# EAGLE schematic VentingSysPCB (EAGLE 9.6.1)
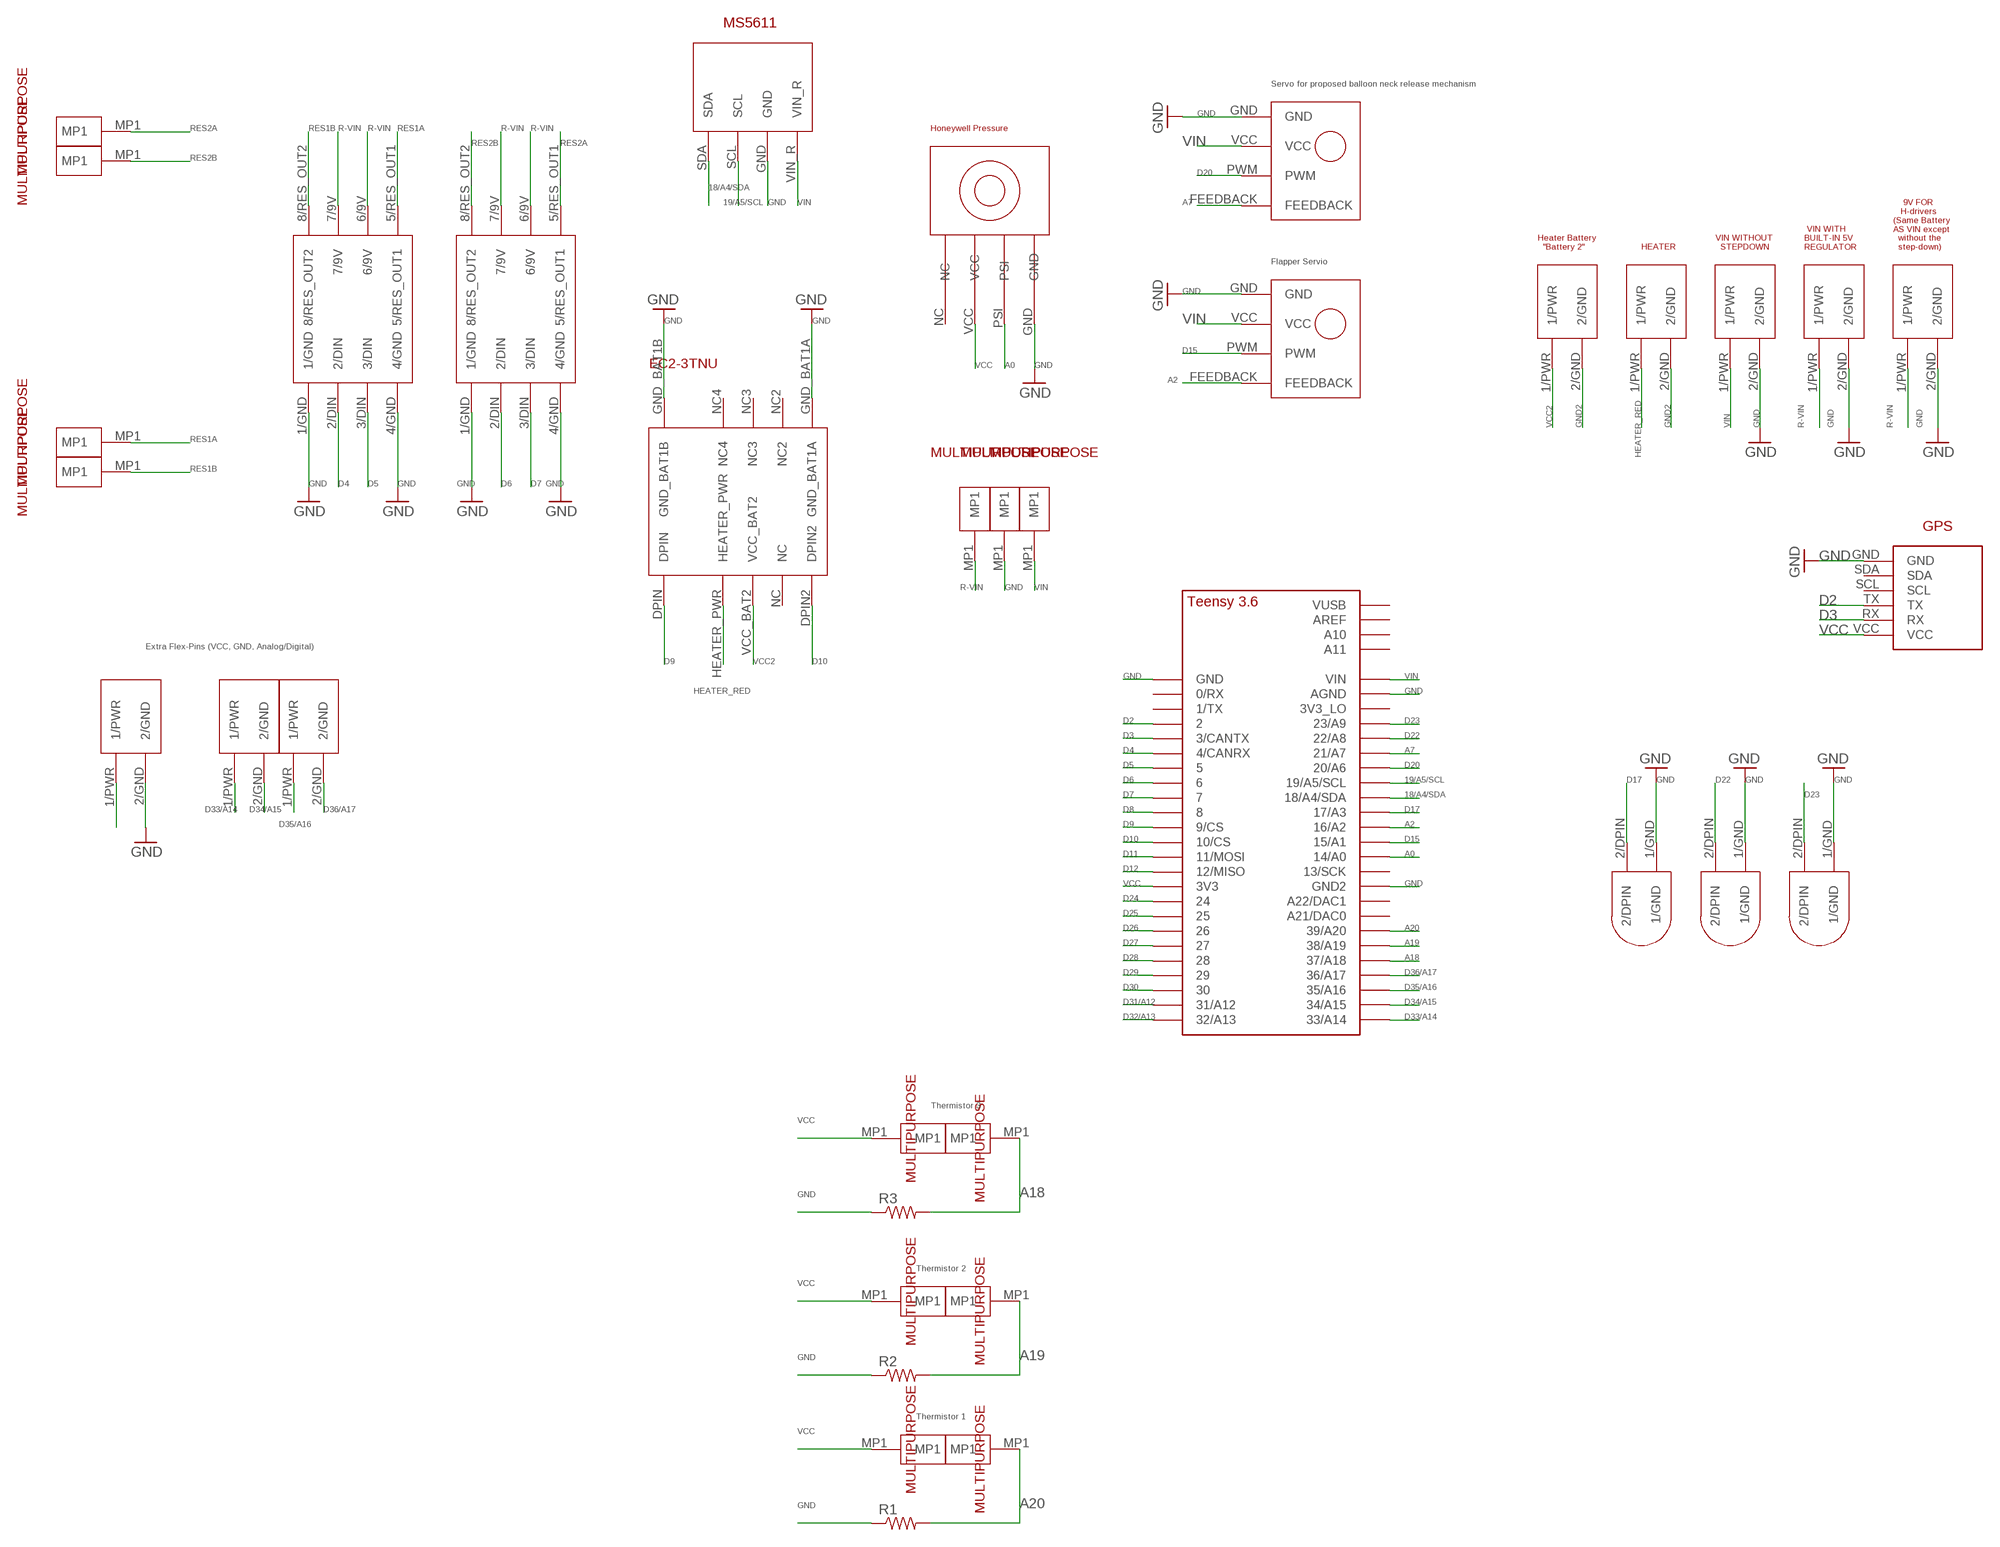
[diagram p0: schematic, sheet 1]

## Parts
R1  R-US_0204/7  [0204/7]
R2  R-US_0204/7  [0204/7]
R3  R-US_0204/7  [0204/7]
U$1  MULTIPURPOSE  [MULTIPURPOSE]
U$2  TEENSY_3.5/3.6_BASIC  [TEENSY_3.5/3.6_BASIC]
U$3  MULTIPURPOSE  [MULTIPURPOSE]
U$4  3V3_H-DRIVER  [3V3_H-DRIVER]
U$5  MULTIPURPOSE  [MULTIPURPOSE]
U$6  3V3_H-DRIVER  [3V3_H-DRIVER]
U$7  ADAFRUIT_LED  [ADAFRUIT_LED]
U$8  MULTIPURPOSE  [MULTIPURPOSE]
U$10  MULTIPURPOSE  [MULTIPURPOSE]
U$12  ADAFRUIT_LED  [ADAFRUIT_LED]
U$13  ADAFRUIT_LED  [ADAFRUIT_LED]
U$14  MULTIPURPOSE  [MULTIPURPOSE]
U$15  MULTIPURPOSE  [MULTIPURPOSE]
U$16  EC2-3TNU_LATCH_RELAY  [EC2-3TNU_LATCH_RELAY]
U$17  FEEDBACK_SERVO  [FEEDBACK_SERVO]
U$18  HONEYWELL_PRESSURE  [HONEYWELL_PRESSURE]
U$19  MS5611_PRESSURE  [MS5611_PRESSURE]
U$20  MULTIPURPOSE  [MULTIPURPOSE]
U$21  MULTIPURPOSE  [MULTIPURPOSE]
U$22  MULTIPURPOSE  [MULTIPURPOSE]
U$23  MULTIPURPOSE  [MULTIPURPOSE]
U$24  TERMINAL_BLOCK  [TERMINAL_BLOCK]
U$25  TERMINAL_BLOCK  [TERMINAL_BLOCK]
U$26  TERMINAL_BLOCK  [TERMINAL_BLOCK]
U$27  TERMINAL_BLOCK  [TERMINAL_BLOCK]
U$28  TERMINAL_BLOCK  [TERMINAL_BLOCK]
U$29  UBLOX-8-GPS  [UBLOX-8-NEO]
U$30  FEEDBACK_SERVO  [FEEDBACK_SERVO]
U$31  TERMINAL_BLOCK  [TERMINAL_BLOCK]
U$32  TERMINAL_BLOCK  [TERMINAL_BLOCK]
U$33  TERMINAL_BLOCK  [TERMINAL_BLOCK]
U$34  MULTIPURPOSE  [MULTIPURPOSE]
U$35  MULTIPURPOSE  [MULTIPURPOSE]

## Nets
18/A4/SDA: U$2.18/A4/SDA U$19.SDA
19/A5/SCL: U$2.19/A5/SCL U$19.SCL
A0: U$2.14/A0 U$18.PSI
A2: U$2.16/A2 U$17.FEEDBACK
A7: U$2.21/A7 U$30.FEEDBACK
A18: R3.2 U$2.37/A18 U$5.MP1
A19: R2.2 U$2.38/A19 U$14.MP1
A20: R1.2 U$2.39/A20 U$34.MP1
D2: U$2.2 U$29.TX
D3: U$2.3/CANTX U$29.RX
D4: U$2.4/CANRX U$6.2/DIN
D5: U$2.5 U$6.3/DIN
D6: U$2.6 U$4.2/DIN
D7: U$2.7 U$4.3/DIN
D8: U$2.8
D9: U$2.9/CS U$16.DPIN
D10: U$2.10/CS U$16.DPIN2
D11: U$2.11/MOSI
D12: U$2.12/MISO
D15: U$2.15/A1 U$17.PWM
D17: U$2.17/A3 U$7.2/DPIN
D20: U$2.20/A6 U$30.PWM
D22: U$2.22/A8 U$12.2/DPIN
D23: U$2.23/A9 U$13.2/DPIN
D24: U$2.24
D25: U$2.25
D26: U$2.26
D27: U$2.27
D28: U$2.28
D29: U$2.29
D30: U$2.30
D31/A12: U$2.31/A12
D32/A13: U$2.32/A13
D33/A14: U$2.33/A14 U$32.1/PWR
D34/A15: U$2.34/A15 U$32.2/GND
D35/A16: U$2.35/A16 U$33.1/PWR
D36/A17: U$2.36/A17 U$33.2/GND
GND: R1.1 R2.1 R3.1 U$2.AGND U$2.GND U$2.GND2 U$3.MP1 U$4.1/GND U$4.4/GND U$6.1/GND U$6.4/GND U$7.1/GND U$12.1/GND U$13.1/GND U$16.GND_BAT1A U$16.GND_BAT1B U$17.GND U$18.GND U$19.GND U$26.2/GND U$27.2/GND U$28.2/GND U$29.GND U$30.GND U$31.2/GND
GND2: U$24.2/GND U$25.2/GND
HEATER_RED: U$16.HEATER_PWR U$25.1/PWR
R-VIN: U$1.MP1 U$4.6/9V U$4.7/9V U$6.6/9V U$6.7/9V U$27.1/PWR U$28.1/PWR
RES1A: U$6.5/RES_OUT1 U$21.MP1
RES1B: U$6.8/RES_OUT2 U$20.MP1
RES2A: U$4.5/RES_OUT1 U$23.MP1
RES2B: U$4.8/RES_OUT2 U$22.MP1
VCC: U$2.3V3 U$10.MP1 U$15.MP1 U$18.VCC U$29.VCC U$31.1/PWR U$35.MP1
VCC2: U$16.VCC_BAT2 U$24.1/PWR
VIN: U$2.VIN U$8.MP1 U$17.VCC U$19.VIN_R U$26.1/PWR U$30.VCC
Unconnected: U$2.0/RX U$2.1/TX U$2.3V3_LO U$2.13/SCK U$2.21/DAC0(A21/DAC0) U$2.A10 U$2.A11 U$2.A22/DAC1 U$2.AREF U$2.VUSB U$16.NC U$16.NC2 U$16.NC3 U$16.NC4 U$18.NC U$29.SCL U$29.SDA

## Notes on the sheet
- Servo for proposed balloon neck release mechanism
- Heater Battery
    "Battery 2"
- HEATER
- VIN WITHOUT
    STEPDOWN
- VIN WITH 
  BUILT-IN 5V
  REGULATOR
- 9V FOR
     H-drivers
  (Same Battery
  AS VIN except
    without the
    step-down)
- Flapper Servio
- GPS
- Extra Flex-Pins (VCC, GND, Analog/Digital)
- Thermistor 3
- Thermistor 2
- Thermistor 1

## Library data of the parts
R1-R3 = adafruit:R-US_: RESISTOR, American symbol
U$1 U$3 U$5 U$8 U$10 U$14 U$15 U$20-U$23 U$34 U$35 = Venting2.0Libr:MULTIPURPOSE
U$2 = Teensy356:TEENSY_3.5/3.6_BASIC
U$4 U$6 = Venting2.0Libr:3V3_H-DRIVER
U$7 U$12 U$13 = Venting2.0Libr:ADAFRUIT_LED
U$16 = Venting2.0Libr:EC2-3TNU_LATCH_RELAY
U$17 U$30 = Venting2.0Libr:FEEDBACK_SERVO
U$18 = Venting2.0Libr:HONEYWELL_PRESSURE
U$19 = Venting2.0Libr:MS5611_PRESSURE
U$24-U$28 U$31-U$33 = Venting2.0Libr:TERMINAL_BLOCK
U$29 = Venting2.0Libr:UBLOX-8-GPS